# Altium schematic sheet EFM Power.SchDoc
size A4
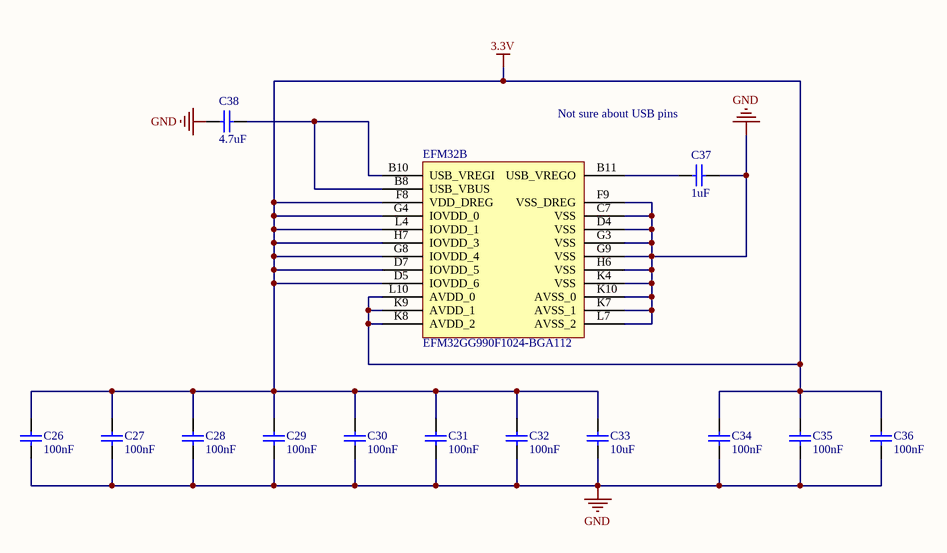
[diagram p0: EFM Power.SchDoc]

## Parts
C26  100nF  [CAPC0603(1608)100_M]
C27  100nF  [CAPC0603(1608)100_M]
C28  100nF  [CAPC0603(1608)100_M]
C29  100nF  [CAPC0603(1608)100_M]
C30  100nF  [CAPC0603(1608)100_M]
C31  100nF  [CAPC0603(1608)100_M]
C32  100nF  [CAPC0603(1608)100_M]
C33  10uF  [CAPC0603(1608)100_M]
C34  100nF  [CAPC0603(1608)100_M]
C35  100nF  [CAPC0603(1608)100_M]
C36  100nF  [CAPC0603(1608)100_M]
C37  1uF  [CAPC0603(1608)100_M]
C38  4.7uF  [CAPC0603(1608)100_M]
EFM32  EFM32GG990F1024-BGA112  [ENMR-BGA112]  (part B of 2)

## Nets
3.3V: C26.2 C27.2 C28.2 C29.2 C30.2 C31.2 C32.1 C33.1 C34.1 C35.1 C36.1 EFM32.D5(IOVDD_6) EFM32.D7(IOVDD_5) EFM32.F8(VDD_DREG) EFM32.G4(IOVDD_0) EFM32.G8(IOVDD_4) EFM32.H7(IOVDD_3) EFM32.K8(AVDD_2) EFM32.K9(AVDD_1) EFM32.L4(IOVDD_1) EFM32.L10(AVDD_0)
GND: C26.1 C27.1 C28.1 C29.1 C30.1 C31.1 C32.2 C33.2 C34.2 C35.2 C36.2 C37.2 C38.1 EFM32.C7(VSS) EFM32.D4(VSS) EFM32.F9(VSS_DREG) EFM32.G3(VSS) EFM32.G9(VSS) EFM32.H6(VSS) EFM32.K4(VSS) EFM32.K7(AVSS_1) EFM32.K10(AVSS_0) EFM32.L7(AVSS_2)
NetC37_1: C37.1 EFM32.B11(USB_VREGO)
NetC38_2: C38.2 EFM32.B8(USB_VBUS) EFM32.B10(USB_VREGI)

## Notes on the sheet
- Not sure about USB pins

## Library data of the parts
C26-C38 = CMP-1035-00001-1: CAP 0.5pF 10V Â±0.1pF 0603 (1608 Metric) Thickness 1mm SMD; Case-EIA: 0603; Case-Metric: 1608; Max Thickness: 1 mm; Tolerance: Â±0.1pF; Technology: SMT; Rated Voltage: 10 V
  C26-C32 C34-C36: Value: 100nF
  C33: Value: 10uF
  C37: Value: 1uF
  C38: Value: 4.7uF
EFM32 = EFM32GG990F1024-BGA112: EFM32 Giant Gecko, M3 ARM Cortex CPU, 1024 KB Flash, 128 KB RAM, 1.85 - 3.8 V Supply, 48 MHz Max Speed, -40 to 85 degC, 112-Pin BGA, RoHS Compliant; Flash (KB): 1024; GPIO: 87; LCD: 8x34; LESENSE: Y; Max Speed (MHz): 48; OPAMPS: 3; RAM (KB): 128; DatasheetVersion: Rev 1.00; PackageVersion: Rev. 97SPP01315A_X03_06Jun11; PackageReference: BGA112; PackageDescription: 112-Pin Ball Grid Array, Body 10 x 10 mm, Pitch 0.8 mm; Supplier 1: Digi-Key; Supplier Part Number 1: 914-1051-2-ND; Supplier 2: Digi-Key; Supplier Part Number 2: 914-1051-1-ND; Supplier 3: Digi-Key; Supplier Part Number 3: 914-1051-6-ND; Supplier 4: Mouser; Supplier Part Number 4: 904-EFM32GG990F1024; ARM Cortex CPU: M3; Subcategory: EFM32 Giant Gecko; Supply Voltage (V): 1.85 - 3.8; USB: Y; Mounting Technology: Surface Mount; Generic Part Number: EFM32GG990; PartNumber: EFM32GG990F1024-BGA112; ComponentLink1Description: Manufacturer URL; ComponentLink1URL: http://www.energymicro.com/; ComponentLink2Description: Datasheet; ComponentLink2URL: http://cdn.energymicro.com/dl/devices/pdf/d0046_efm32gg990_datasheet.pdf; ComponentLink3Description: Package Specification; ComponentLink3URL: http://cdn.energymicro.com/dl/devices/pdf/d0007_efm32g290_datasheet.pdf